# EAGLE schematic ShifterBit2 (EAGLE 7.4.0)
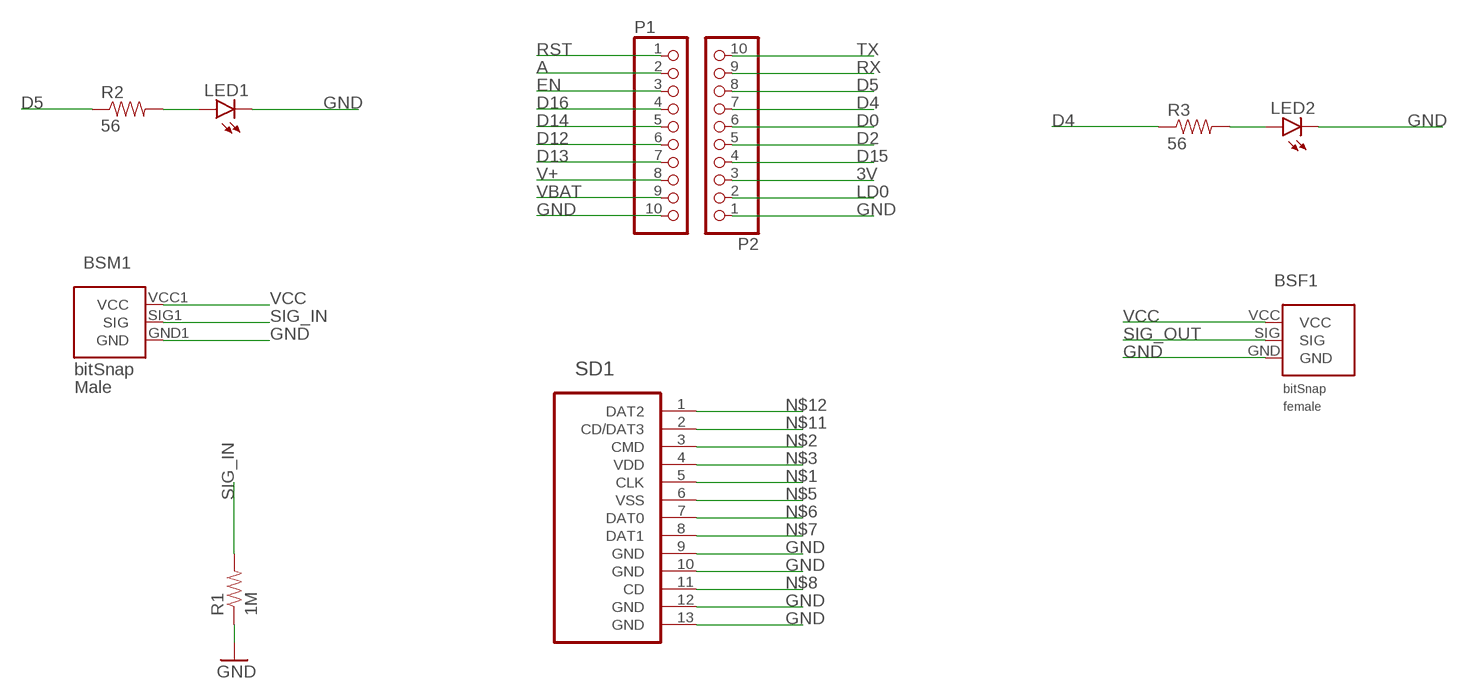
[diagram p0: schematic, sheet 1]

## Parts
BSF1  BITSNAP_V03_FEMALE  [BITSNAP_V03_FEMALE]
BSM1  BITSNAP_V03_MALE  [BITSNAP_V03_MALE]
LED1  LED-GREEN0603  [LED-0603]
LED2  LED-GREEN0603  [LED-0603]
P1  PINHD-1X10  [1X10-BIG]
P2  PINHD-1X10  [1X10-BIG]
R1  1M  RESISTOR0603  [RES-0603]
R2  56  RESISTOR0603-RES  [0603-RES]
R3  56  RESISTOR0603-RES  [0603-RES]
SD1  HIROSE_DM3CS-SF  [HIROSE_DM3CS-SF]

## Nets
3V: P2.3
A: P1.2
D0: P2.6
D2: P2.5
D4: P2.7 R3.1
D5: P2.8 R2.1
D12: P1.6
D13: P1.7
D14: P1.5
D15: P2.4
D16: P1.4
EN: P1.3
GND: BSF1.GND BSM1.GND1(GND) LED1.C LED2.C P1.10 P2.1 R1.1 SD1.9(GND) SD1.10(GND) SD1.12(GND) SD1.13(GND)
LD0: P2.2
N$1: SD1.5(CLK)
N$2: SD1.3(CMD)
N$3: SD1.4(VDD)
N$4: LED1.A R2.2
N$5: SD1.6(VSS)
N$6: SD1.7(DAT0)
N$7: SD1.8(DAT1)
N$8: SD1.11(CD)
N$9: LED2.A R3.2
N$11: SD1.2(CD/DAT3)
N$12: SD1.1(DAT2)
RST: P1.1
RX: P2.9
SIG_IN: BSM1.SIG1(SIG) R1.2
SIG_OUT: BSF1.SIG
TX: P2.10
V+: P1.8
VBAT: P1.9
VCC: BSF1.VCC BSM1.VCC1(VCC)

## Library data of the parts
BSF1 = bitSnap:BITSNAP_V03_FEMALE
BSM1 = bitSnap:BITSNAP_V03_MALE
LED1 LED2 = SparkFun-LED:LED-GREEN: Various green LEDs Green LEDs used in SFE Production 0603- DIO-00821 LARGE- DIO-00862 LILYPAD- DIO-09910; PROD_ID: DIO-00821; VALUE: GREEN
P1 P2 = adafruit:PINHD-1X10: Pin header 1x10 0.1" spacing With round pins
R1 = LITTLEBITS:RESISTOR
R2 R3 = SparkFun-Passives:RESISTOR: Resistor Basic schematic elements and footprints for 0603, 1206, and PTH resistors.
SD1 = HIROSE-DM3CS-SF:HIROSE_DM3CS-SF: DM3CS, Hinge, Push -Pull (no ejection mechanism), Top board mounting (Standard); MPN: DM3CS-SF; OC_FARNELL: 1764376; OC_NEWARK: 35R0581; PACKAGE: SMD - microSD; SUPPLIER: HIROSE